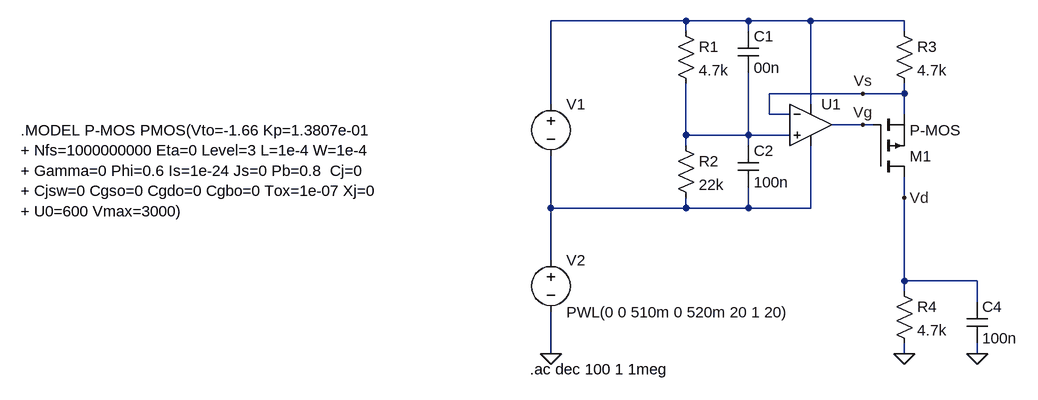
[diagram p0: schematic Balancer_voltage.asc]
Balancer_voltage.asc, the LTspice schematic file:
Version 4
SHEET 1 1272 680
WIRE 128 -16 -80 -16
WIRE 224 -16 128 -16
WIRE 320 -16 224 -16
WIRE 464 -16 320 -16
WIRE 128 0 128 -16
WIRE 224 0 224 -16
WIRE 464 0 464 -16
WIRE 400 96 256 96
WIRE 464 96 464 80
WIRE 464 96 400 96
WIRE -80 112 -80 -16
WIRE 320 112 320 -16
WIRE 256 128 256 96
WIRE 288 128 256 128
WIRE 464 128 464 96
WIRE 400 144 352 144
WIRE 416 144 400 144
WIRE 128 160 128 80
WIRE 224 160 224 64
WIRE 224 160 128 160
WIRE 288 160 224 160
WIRE 128 176 128 160
WIRE 224 176 224 160
WIRE 464 256 464 224
WIRE -80 272 -80 192
WIRE 128 272 128 256
WIRE 128 272 -80 272
WIRE 224 272 224 240
WIRE 224 272 128 272
WIRE 320 272 320 176
WIRE 320 272 224 272
WIRE -80 352 -80 272
WIRE 464 384 464 256
WIRE 576 384 464 384
WIRE 464 400 464 384
WIRE 576 416 576 384
WIRE -80 496 -80 432
WIRE 464 496 464 480
WIRE 576 496 576 480
FLAG 464 496 0
FLAG -80 496 0
FLAG 400 144 Vg
FLAG 400 96 Vs
FLAG 464 256 Vd
FLAG 576 496 0
SYMBOL res 112 -16 R0
SYMATTR InstName R1
SYMATTR Value 4.7k
SYMBOL res 112 160 R0
SYMATTR InstName R2
SYMATTR Value 22k
SYMBOL cap 208 176 R0
SYMATTR InstName C2
SYMATTR Value 100n
SYMBOL res 448 384 R0
SYMATTR InstName R4
SYMATTR Value 4.7k
SYMBOL res 448 -16 R0
SYMATTR InstName R3
SYMATTR Value 4.7k
SYMBOL OpAmps\\UniversalOpAmp2 320 144 R0
SYMATTR InstName U1
SYMBOL voltage -80 96 R0
WINDOW 3 -444 62 Invisible 2
WINDOW 39 0 0 Left 0
SYMATTR Value PWL(0 2.5 100m 2.5 400m 4.5 480m 4.5 490m 2.5 600m 2.5 900m 4.5 1 4.5)
SYMATTR Value2 AC 1
SYMATTR InstName V1
SYMBOL pmos 416 224 M180
SYMATTR InstName M1
SYMATTR Value P-MOS
SYMBOL voltage -80 336 R0
WINDOW 123 0 0 Left 0
WINDOW 39 0 0 Left 0
SYMATTR InstName V2
SYMATTR Value PWL(0 0 510m 0 520m 20 1 20)
SYMBOL cap 560 416 R0
SYMATTR InstName C4
SYMATTR Value 100n
SYMBOL cap 208 0 R0
SYMATTR InstName C1
SYMATTR Value 00n
TEXT -112 520 Left 2 !.ac dec 100 1 1meg
TEXT -896 152 Left 2 !.MODEL P-MOS PMOS(Vto=-1.66 Kp=1.3807e-01\n+ Nfs=1000000000 Eta=0 Level=3 L=1e-4 W=1e-4 \n+ Gamma=0 Phi=0.6 Is=1e-24 Js=0 Pb=0.8  Cj=0 \n+ Cjsw=0 Cgso=0 Cgdo=0 Cgbo=0 Tox=1e-07 Xj=0\n+ U0=600 Vmax=3000)

The netlist it stands for:
* Balancer_voltage.asc
R1 N001 N002 4.7k
R2 N002 N003 22k
C2 N002 N003 100n
R4 Vd 0 4.7k
R3 N001 Vs 4.7k
XU1 N002 Vs N001 N003 Vg level2 Avol=1Meg GBW=10Meg Slew=10Meg Ilimit=25m Rail=0 Vos=0 En=0 Enk=0 In=0 Ink=0 Rin=500Meg  ; pins In+ In- V+ V- OUT
V1 N001 N003 PWL(0 2.5 100m 2.5 400m 4.5 480m 4.5 490m 2.5 600m 2.5 900m 4.5 1 4.5) AC 1
M1 Vd Vg Vs Vs P-MOS
V2 N003 0 PWL(0 0 510m 0 520m 20 1 20)
C4 Vd 0 100n
C1 N001 N002 00n
.model NMOS NMOS
.model PMOS PMOS
.lib standard.mos
.ac dec 100 1 1meg
.MODEL P-MOS PMOS(Vto=-1.66 Kp=1.3807e-01
+ Nfs=1000000000 Eta=0 Level=3 L=1e-4 W=1e-4
+ Gamma=0 Phi=0.6 Is=1e-24 Js=0 Pb=0.8  Cj=0
+ Cjsw=0 Cgso=0 Cgdo=0 Cgbo=0 Tox=1e-07 Xj=0
+ U0=600 Vmax=3000)
.lib UniversalOpAmp2.lib
.backanno
.end